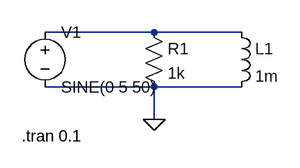
[diagram p0: schematic LR Parallel Circuit with Sine wave.asc]
LR Parallel Circuit with Sine wave.asc, the LTspice schematic file:
Version 4
SHEET 1 880 680
WIRE 336 112 176 112
WIRE 464 112 336 112
WIRE 336 192 176 192
WIRE 464 192 336 192
WIRE 336 240 336 192
FLAG 336 240 0
SYMBOL res 320 96 R0
SYMATTR InstName R1
SYMATTR Value 1k
SYMBOL ind 448 96 R0
SYMATTR InstName L1
SYMATTR Value 1m
SYMBOL voltage 176 96 R0
WINDOW 123 0 0 Left 0
WINDOW 39 0 0 Left 0
SYMATTR InstName V1
SYMATTR Value SINE(0 5 50)
TEXT 142 264 Left 2 !.tran 0.1

The netlist it stands for:
* LR Parallel Circuit with Sine wave.asc
R1 N001 0 1k
L1 N001 0 1m
V1 N001 0 SINE(0 5 50)
.tran 0.1
.backanno
.end